# Altium schematic sheet JacdacNRF52833HighPower 32.SchDoc: complete design
size A3; DocumentNumber: 1; SheetNumber: 1; SheetTotal: 1; VersionControl_RevNumber: 1
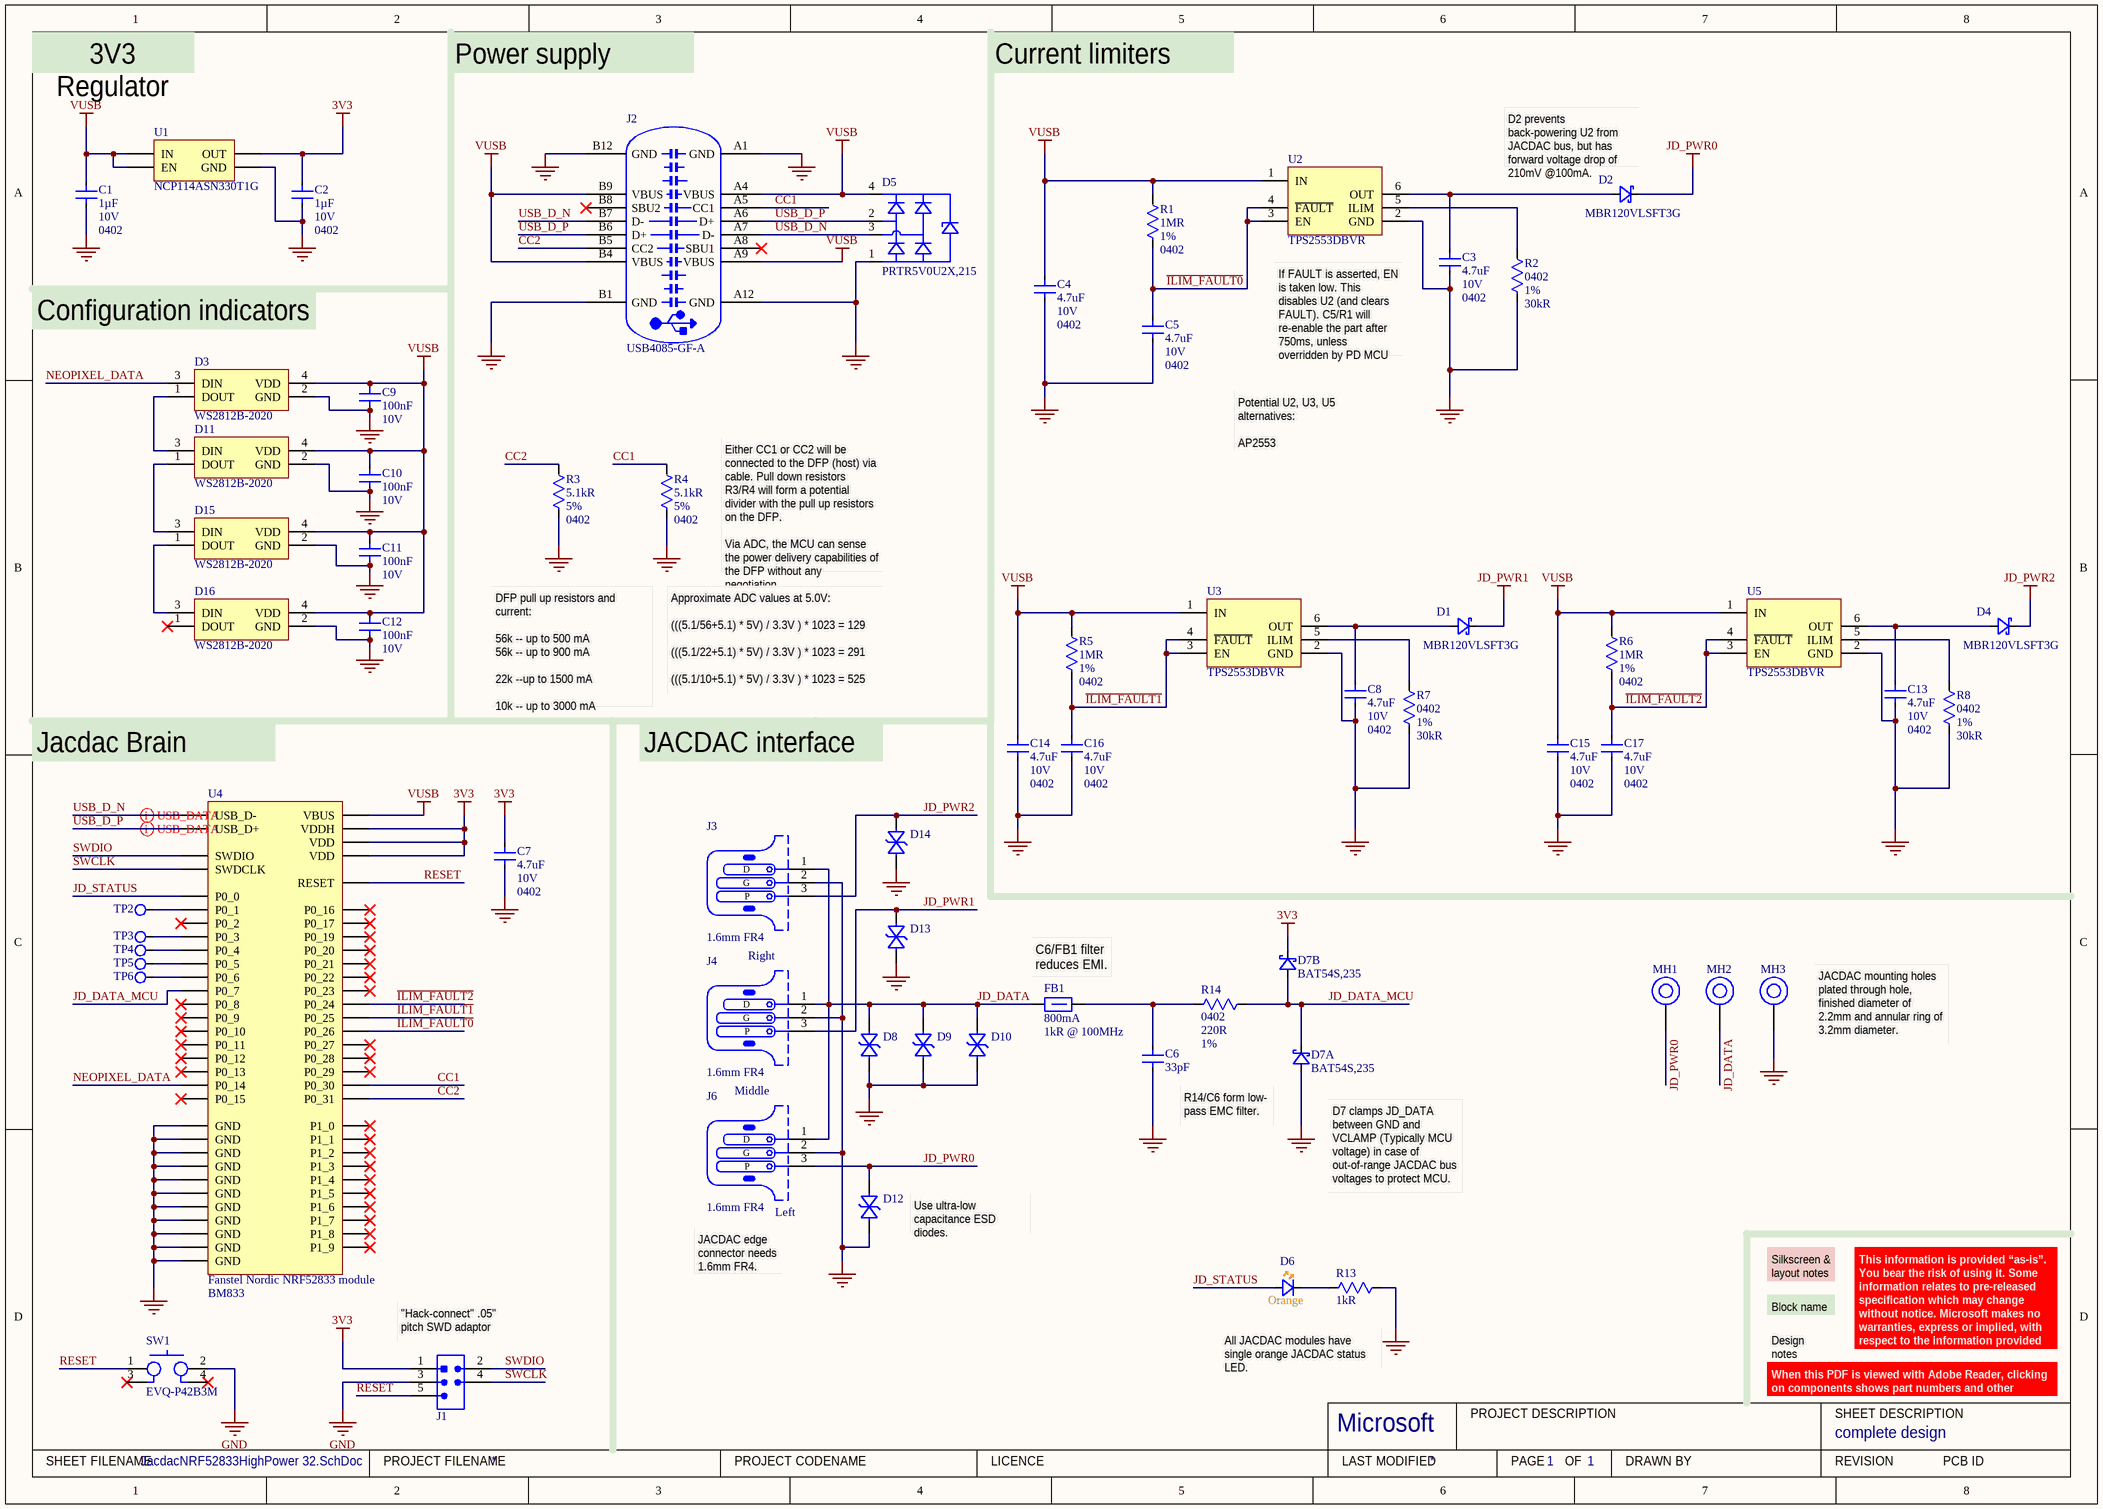
[diagram p0: JacdacNRF52833HighPower 32.SchDoc]

## Parts
C1  Capacitance: 1µF  Voltage Rating: 10V  Case Code (Imperial): 0402  [C0402_0.55MM - without outline]  (hidden comment: CL05A105KP5NNNC)
C2  Capacitance: 1µF  Voltage Rating: 10V  Case Code (Imperial): 0402  [C0402_0.55MM - without outline]  (hidden comment: CL05A105KP5NNNC)
C3  Capacitance: 4.7uF  Voltage Rating: 10V  Case Code (Imperial): 0402  [R0402 - Without outline]  (hidden comment: CL05A475MP5NRNC)
C4  Capacitance: 4.7uF  Voltage Rating: 10V  Case Code (Imperial): 0402  [R0402 - Without outline]  (hidden comment: CL05A475MP5NRNC)
C5  Capacitance: 4.7uF  Voltage Rating: 10V  Case Code (Imperial): 0402  [R0402 - Without outline]  (hidden comment: CL05A475MP5NRNC)
C6  Capacitance: 33pF  [C0402_0.55MM - without outline]  (hidden comment: CL05C330JB51PNC)
C7  Capacitance: 4.7uF  Voltage Rating: 10V  Case Code (Imperial): 0402  [R0402 - Without outline]  (hidden comment: CL05A475MP5NRNC)
C8  Capacitance: 4.7uF  Voltage Rating: 10V  Case Code (Imperial): 0402  [R0402 - Without outline]  (hidden comment: CL05A475MP5NRNC)
C9  Capacitance: 100nF  Voltage Rating: 10V  [C0402_0.55MM - without outline]  (hidden comment: CL05B104KP5NNNC)
C10  Capacitance: 100nF  Voltage Rating: 10V  [C0402_0.55MM - without outline]  (hidden comment: CL05B104KP5NNNC)
C11  Capacitance: 100nF  Voltage Rating: 10V  [C0402_0.55MM - without outline]  (hidden comment: CL05B104KP5NNNC)
C12  Capacitance: 100nF  Voltage Rating: 10V  [C0402_0.55MM - without outline]  (hidden comment: CL05B104KP5NNNC)
C13  Capacitance: 4.7uF  Voltage Rating: 10V  Case Code (Imperial): 0402  [R0402 - Without outline]  (hidden comment: CL05A475MP5NRNC)
C14  Capacitance: 4.7uF  Voltage Rating: 10V  Case Code (Imperial): 0402  [R0402 - Without outline]  (hidden comment: CL05A475MP5NRNC)
C15  Capacitance: 4.7uF  Voltage Rating: 10V  Case Code (Imperial): 0402  [R0402 - Without outline]  (hidden comment: CL05A475MP5NRNC)
C16  Capacitance: 4.7uF  Voltage Rating: 10V  Case Code (Imperial): 0402  [R0402 - Without outline]  (hidden comment: CL05A475MP5NRNC)
C17  Capacitance: 4.7uF  Voltage Rating: 10V  Case Code (Imperial): 0402  [R0402 - Without outline]  (hidden comment: CL05A475MP5NRNC)
D1  MBR120VLSFT3G  [MBR120VLSFT3G]
D2  MBR120VLSFT3G  [MBR120VLSFT3G]
D3  WS2812B-2020  [WS2812B-2020]
D4  MBR120VLSFT3G  [MBR120VLSFT3G]
D5  Manufacturer Part Number: PRTR5V0U2X,215  [NXP-SOT143B-4_V]  (hidden comment: NXP-PRTR5V0U2X,215-4-whitesch)
D6  Right angle mount LED (orange)  [LTST-S220KFKT]  (value not drawn)
D7  Manufacturer Part Number: BAT54S,235  [NXP-BAT54S-TO-236AB]  (hidden comment: BAT54S)  (parts A,B of 2)
D8  VBUS05B1-SD0-G4-08  [0201-VBUS05B1-SD0-G4-08 - Without outline]  (value not drawn)
D9  VBUS05B1-SD0-G4-08  [0201-VBUS05B1-SD0-G4-08 - Without outline]  (value not drawn)
D10  VBUS05B1-SD0-G4-08  [0201-VBUS05B1-SD0-G4-08 - Without outline]  (value not drawn)
D11  WS2812B-2020  [WS2812B-2020]
D12  VBUS05B1-SD0-G4-08  [0201-VBUS05B1-SD0-G4-08 - Without outline]  (value not drawn)
D13  VBUS05B1-SD0-G4-08  [0201-VBUS05B1-SD0-G4-08 - Without outline]  (value not drawn)
D14  VBUS05B1-SD0-G4-08  [0201-VBUS05B1-SD0-G4-08 - Without outline]  (value not drawn)
D15  WS2812B-2020  [WS2812B-2020]
D16  WS2812B-2020  [WS2812B-2020]
FB1  Current Rating: 800mA  Impedance: 1kR @ 100MHz  [TDK MPZ1608 0.8mm - without outline]  (hidden comment: TDK MPZ1608S102ATA00)
J1  Hack Connect Mini 1.27 mm pitch 2-row  [HACK_CONNECT_MINI_5_X_1_27]  (value not drawn)  (no BOM)
J2  USB4085-GF-A  [USB4085-GF-A]
J3  PCB Type: 1.6mm FR4  [JACDAC_EDGE_CONNECTOR_0.2mm_T&G]  (hidden comment: JACDAC edge connector)  (no BOM)
J4  PCB Type: 1.6mm FR4  [JACDAC_EDGE_CONNECTOR_0.2mm_T&G]  (hidden comment: JACDAC edge connector)  (no BOM)
J6  PCB Type: 1.6mm FR4  [JACDAC_EDGE_CONNECTOR_0.2mm_T&G]  (hidden comment: JACDAC edge connector)  (no BOM)
MH1  MH_5.0MMK_3.0MMC_2.1MMD_PTH  [MH_5.0MMK_3.0MMC_2.1MMD_PTH]  (value not drawn)  (no BOM)
MH2  MH_5.0MMK_3.0MMC_2.1MMD_PTH  [MH_5.0MMK_3.0MMC_2.1MMD_PTH]  (value not drawn)  (no BOM)
MH3  MH_5.0MMK_3.0MMC_2.1MMD_PTH  [MH_5.0MMK_3.0MMC_2.1MMD_PTH]  (value not drawn)  (no BOM)
R1  Resistance: 1MR  Tolerance: 1%  Case Code (Imperial): 0402  [R0402 - Without outline]
R2  Case/Package: 0402  Tolerance: 1%  Resistance: 30kR  [R0402]  (hidden comment: 0402 RES SMD 30k 1%)
R3  Resistance: 5.1kR  Tolerance: 5%  Case Code (Imperial): 0402  [R0402 - Without outline]  (hidden comment: RC0402JR-075K1L)
R4  Resistance: 5.1kR  Tolerance: 5%  Case Code (Imperial): 0402  [R0402 - Without outline]  (hidden comment: RC0402JR-075K1L)
R5  Resistance: 1MR  Tolerance: 1%  Case Code (Imperial): 0402  [R0402 - Without outline]
R6  Resistance: 1MR  Tolerance: 1%  Case Code (Imperial): 0402  [R0402 - Without outline]
R7  Case/Package: 0402  Tolerance: 1%  Resistance: 30kR  [R0402]  (hidden comment: 0402 RES SMD 30k 1%)
R8  Case/Package: 0402  Tolerance: 1%  Resistance: 30kR  [R0402]  (hidden comment: 0402 RES SMD 30k 1%)
R13  Resistance: 1kR  [R0402 - Without outline]  (hidden comment: RC0402FR-071KL)
R14  Case Code (Imperial): 0402  Resistance: 220R  Tolerance: 1%  [R0402 - Without outline]  (hidden comment: RC0402FR-07220RL)
SW1  Side mount digital switch.  [EVQ-P42B3M]  (value not drawn)
TP2  TestPoint  [Pad1.27mm]  (value not drawn)  (no BOM)
TP3  TestPoint  [Pad1.27mm]  (value not drawn)  (no BOM)
TP4  TestPoint  [Pad1.27mm]  (value not drawn)  (no BOM)
TP5  TestPoint  [Pad1.27mm]  (value not drawn)  (no BOM)
TP6  TestPoint  [Pad1.27mm]  (value not drawn)  (no BOM)
U1  LDO 3.3V/300 mA  [ON_SEMI-SOT23-5]  (value not drawn)
U2  Manufacturer Part Number 1: TPS2553DBVR  [TI-TPS2553]  (hidden comment: TPS2553DBVR_ALT)
U3  Manufacturer Part Number 1: TPS2553DBVR  [TI-TPS2553]  (hidden comment: TPS2553DBVR_ALT)
U4  Fanstel Nordic NRF52833 module  [BM833]
U5  Manufacturer Part Number 1: TPS2553DBVR  [TI-TPS2553]  (hidden comment: TPS2553DBVR_ALT)

## Nets
3V3: C2.2 C7.2 D7.2(K) J1.1(VCC) U1.5(OUT) U4.14(VDD) U4.28(VDD) U4.56(VDDH)
GND: C1.1 C2.1 C3.1 C4.1 C5.1 C6.1 C7.1 C8.1 C9.1 C10.1 C11.1 C12.1 C13.1 C14.1 C15.1 C16.1 C17.1 D3.2(GND) D5.1(GND) D7.1(A) D8.2(A) D9.2(A) D10.2(A) D11.2(GND) D12.2(A) D13.2(A) D14.2(A) D15.2(GND) D16.2(GND) J1.3(GND) J2.A1(GND) J2.A12(GND) J2.B1(GND) J2.B12(GND) J3.2(G) J4.2(G) J6.2(G) MH3.1 R2.1 R3.2 R4.2 R7.1 R8.1 R13.1 SW1.2(B) U1.2(GND) U2.2(GND) U3.2(GND) U4.1(GND) U4.2(GND) U4.3(GND) U4.4(GND) U4.5(GND) U4.13(GND) U4.15(GND) U4.18(GND) U4.19(GND) U4.30(GND) U4.45(GND) U5.2(GND)
JD_PWR0: D2.1(K) D12.1(K) J6.3(P) MH1.1
JD_PWR1: D1.1(K) D13.1(K) J4.3(P)
JD_PWR2: D4.1(K) D14.1(K) J3.3(P)
VUSB: C1.2 C4.2 C9.2 C10.2 C11.2 C12.2 C14.2 C15.2 D3.4(VDD) D5.4(VCC) D11.4(VDD) D15.4(VDD) D16.4(VDD) J2.A4(VBUS) J2.A9(VBUS) J2.B4(VBUS) J2.B9(VBUS) R1.1 R5.1 R6.1 U1.1(IN) U1.3(EN) U2.1(IN) U3.1(IN) U4.58(VBUS) U5.1(IN)
~{ILIM_FAULT0}: C5.2 R1.2 U2.3(EN) U2.4(~{FAULT}) U4.7(P0_26)
~{ILIM_FAULT1}: C16.2 R5.2 U3.3(EN) U3.4(~{FAULT}) U4.55(P0_25)
~{ILIM_FAULT2}: C17.2 R6.2 U4.47(P0_24) U5.3(EN) U5.4(~{FAULT})
CC1: J2.A5(CC1) R4.1 U4.11(P0_30)
CC2: J2.B5(CC2) R3.1 U4.12(P0_31)
JD_DATA: D8.1(K) D9.1(K) D10.1(K) FB1.1 J3.1(D) J4.1(D) J6.1(D) MH2.1
JD_DATA_MCU: D7.3(K) R14.1 U4.24(P0_7)
JD_STATUS: D6.2(A) U4.16(P0_0)
NEOPIXEL_DATA: D3.3(DIN) U4.33(P0_14)
RESET: J1.5(RESET) SW1.1(A) U4.40(RESET)
SWCLK: J1.4(SWCLK) U4.42(SWDCLK)
SWDIO: J1.2(SWDIO) U4.43(SWDIO)
USB_D_N: D5.3(I/O2) J2.A7(D-) J2.B7(D-) U4.68(USB_D-)
USB_D_P: D5.2(I/O1) J2.A6(D+) J2.B6(D+) U4.67(USB_D+)
NetC3_2: C3.2 D2.2(A) U2.6(OUT)
NetC6_2: C6.2 FB1.2 R14.2
NetC8_2: C8.2 D1.2(A) U3.6(OUT)
NetC13_2: C13.2 D4.2(A) U5.6(OUT)
NetD3_1: D3.1(DOUT) D11.3(DIN)
NetD6_1: D6.1(K) R13.2
NetD11_1: D11.1(DOUT) D15.3(DIN)
NetD15_1: D15.1(DOUT) D16.3(DIN)
NetR2_2: R2.2 U2.5(ILIM)
NetR7_2: R7.2 U3.5(ILIM)
NetR8_2: R8.2 U5.5(ILIM)
NetTP2_1: TP2.1 U4.17(P0_1)
NetTP3_1: TP3.1 U4.20(P0_3)
NetTP4_1: TP4.1 U4.21(P0_4)
NetTP5_1: TP5.1 U4.23(P0_5)
NetTP6_1: TP6.1 U4.25(P0_6)

Not connected (* = marked no-connect by the designer): D16 1(DOUT)*; J2 A8(SBU1)* B8(SBU2)*; SW1 3(A)* 4(B)*; U4 8(P0_27)* 9(P0_28)* 10(P0_29)* 22(P0_2)* 26(P0_9)* 27(P0_8)* 29(P0_10)* 31(P1_1)* 32(P1_2)* 34(P0_11)* 35(P0_15)* 36(P0_16)* 37(P0_17)* 38(P1_0)* 41(P0_13)* 44(P0_22)* 48(P0_19)* 49(P1_3)* 51(P1_5)* 52(P1_9)* 53(P0_23)* 54(P1_8)* 60(P0_21)* 61(P1_4)* 62(P0_20)* 64(P0_12)* 65(P1_6)* 66(P1_7)*

## Layout directives
differential pair; rule Signal Stimulus [Kind - Single Pulse    Level - High    Start Time = 0.000    Stop Time = 41.67n    Period Time = 83.33n]: USB_D_N
differential pair; rule Signal Stimulus [Kind - Single Pulse    Level - High    Start Time = 0.000    Stop Time = 500.0m    Period Time = 1.000]: USB_D_P

## Notes on the sheet
- 3V3 Regulator
- Power supply
- Current limiters
- (near D2) D2 prevents back-powering U2 from JACDAC bus, but has forward voltage drop of 210mV @100mA.
- Configuration indicators
- If FAULT is asserted, EN is taken low. This disables U2 (and clears FAULT). C5/R1 will re-enable the part after 750ms, unless overridden by PD MCU
- Potential U2, U3, U5 alternatives:
  AP2553
- Either CC1 or CC2 will be connected to the DFP (host) via cable. Pull down resistors R3/R4 will form a potential divider with the pull up resistors on the DFP.
  Via ADC, the MCU can sense the power delivery capabilities of the DFP without any negotiation.
- DFP pull up resistors and current:
  56k -- up to 500 mA
  56k -- up to 900 mA
  22k --up to 1500 mA
  10k -- up to 3000 mA
- Approximate ADC values at 5.0V:
  (((5.1/56+5.1) * 5V) / 3.3V ) * 1023 = 129
  (((5.1/22+5.1) * 5V) / 3.3V ) * 1023 = 291
  (((5.1/10+5.1) * 5V) / 3.3V ) * 1023 = 525
- Jacdac Brain
- JACDAC interface
- Right
- (near FB1) C6/FB1 filter reduces EMI.
- (near MH3) JACDAC mounting holes  plated through hole, finished diameter of 2.2mm and annular ring of 3.2mm diameter.
- Middle
- R14/C6 form low-
  pass EMC filter.
- (near D7) D7 clamps JD_DATA between GND and VCLAMP (Typically MCU voltage) in case of out-of-range JACDAC bus voltages to protect MCU.
- (near J6) Left
- (near D12) Use ultra-low capacitance ESD diodes.
- JACDAC edge connector needs 1.6mm FR4.
- Block name
- Silkscreen & layout notes
- (near J1) "Hack-connect" .05" pitch SWD adaptor
- All JACDAC modules have single orange JACDAC status LED.
- Design notes
- When this PDF is viewed with Adobe Reader, clicking on components shows part numbers and other details.
- This information is provided “as-is”. You bear the risk of using it. Some information relates to pre-released specification which may change without notice. Microsoft makes no warranties, express or implied, with respect to the information provided here.
- Microsoft
- PROJECT DESCRIPTION
- SHEET DESCRIPTION
- SHEET FILENAME
- PROJECT FILENAME
- PROJECT CODENAME
- LICENCE
- LAST MODIFIED
- PAGE
- OF
- DRAWN BY
- REVISION
- PCB ID

## Library data of the parts
C1 C2 = CL05A105KP5NNNC: CAP CER 1UF 10V X5R 0402; Manufacturer: Samsung; Material: Ceramic; Tolerance: 10%; Supplier 1: Digi-Key; Manufacturer Part Number: CL05A105KP5NNNC; RoHS: Yes; Category: Capacitors; Stock 1: 5705569; Pricing 1: 1=0.10000, 10=0.03900, 50=0.02100, 100=0.01720, 500=0.01228, 1000=0.00965, 2500=0.00877, 5000=0.00807 (USD); Mount: Surface Mount; Case/Package: 0402; Case Code (Metric): 1005; Contact Plating: Tin; Min Operating Temperature: -55°C; Max Operating Temperature: 85°C; Dielectric: X5R; Package Quantity: 1; Packaging: Tape and Reel; Length: 1mm; Height: 0.5mm; Width: 0.02inch; Thickness: 0.022inch; Depth: 0.5mm; Radiation Hardening: No; ComponentLink1URL: https://datasheet.ciiva.com/15195/getdatasheetpartid-358390-15195630.pdf; ComponentLink1Description: Online datasheet; Supplier 2: Mouser; Stock 2: 928941; Pricing 2: 1=0.10000, 10=0.04200, 100=0.01800, 500=0.01300, 1000=0.01000, 2500=0.00900 (USD); Supplier 3: Farnell; Stock 3: 53670; Pricing 3: 10=0.02450, 100=0.02000, 500=0.01310, 2500=0.00920, 5000=0.00810, 10000=0.00640, 50000=0.00490 (GBP); Supplier Part Number 3: 3013329; Supplier Part Number 2: 187-CL05A105KP5NNNC; Supplier Part Number 1: 1276-1076-1-ND; Created: DG; Checked: ?
C3-C5 C7 C8 C13-C17 = CL05A475MP5NRNC: CAP CER 4.7UF 10V X5R 0402; Manufacturer: Samsung; Tolerance: 20%; Supplier 1: Digi-Key; Manufacturer Part Number: CL05A475MP5NRNC; RoHS: Yes; Category: Ceramic Capacitors; Stock 1: 840000; Pricing 1: 10000=0.01405, 20000=0.01338 (USD); Mount: Surface Mount; Case/Package: 0402; Case Code (Metric): 1005; Min Operating Temperature: -55°C; Max Operating Temperature: 85°C; Package Quantity: 10000; Packaging: Tape and Reel; Dielectric: X5R; Series: CL; Length: 0.039inch; Width: 0.02inch; Thickness: 0.022inch; Lead Free: Lead Free; RoHS Compliant: Yes; ComponentLink1URL: https://datasheet.ciiva.com/25786/cl05a475mp5nrnc-25786963.pdf; ComponentLink1Description: Online datasheet; Supplier 2: Future Electronics; Stock 2: 2004; Pricing 2: 1=0.23500, 500=0.03970, 1500=0.02900, 2500=0.02500, 5000=0.02050 (USD); Created By: D. Gakure; Checked By: ?; Supplier Part Number 2: 2103694; Supplier Part Number 1: 1276-1482-2-ND
C6 = CL05C330JB51PNC: CAP CER 33PF 50V NP0 0402; Manufacturer: Samsung; Tolerance: 5%; Supplier 1: Digi-Key; Manufacturer Part Number: CL05C330JB51PNC; RoHS: Yes; Category: Capacitors; Stock 1: 250654; Pricing 1: 1=0.10000, 10=0.07500, 50=0.04060, 100=0.03320, 500=0.02374, 1000=0.01865, 2500=0.01696, 5000=0.01560 (USD); Mount: Surface Mount; Case/Package: 0402; Case Code (Metric): 1005; Min Operating Temperature: -55°C; Max Operating Temperature: 125°C; Packaging: Tape and Reel; Length: 0.039inch; Width: 0.02inch; Thickness: 0.022inch; Ratings: AEC-Q200; Lead Free: Lead Free; ComponentLink1URL: http://www.samsungsem.com/kr/support/library/product-catalog/mlcc.jsp; ComponentLink1Description: Samsung datasheet online; Supplier 2: Mouser; Stock 2: 97900; Pricing 2: 1=0.11000, 10=0.08200, 100=0.03600, 500=0.02600, 1000=0.02000, 2500=0.01800 (USD); Supplier 3: Future Electronics; Stock 3: 100000; Pricing 3: 10000=0.00780 (USD); Supplier Part Number 3: 6022520; Supplier Part Number 2: 187-CL05C330JB51PNC; Checked: ?; Created: DG; Supplier Part Number 1: 1276-6515-1-ND; Voltage Rating: 50V; Case Code (Imperial): 0402
C9-C12 = CL05B104KP5NNNC: CAP CER 0.1UF 10V X7R 0402; Manufacturer: Samsung; Tolerance: 10%; Supplier 1: Digi-Key; Manufacturer Part Number: CL05B104KP5NNNC; RoHS: Yes; Category: Ceramic Capacitors; Stock 1: 17321183; Pricing 1: 1=0.10000, 10=0.02500, 50=0.01380, 100=0.01130, 500=0.00804, 1000=0.00632, 2500=0.00575, 5000=0.00529 (USD); Mount: Surface Mount; Case/Package: 0402; Case Code (Imperial): 0402; Case Code (Metric): 1005; Contact Plating: Tin; Min Operating Temperature: -55°C; Max Operating Temperature: 125°C; Package Quantity: 1; Packaging: Tape and Reel; Dielectric: X7R; Length: 1mm; Width: 0.02inch; Height: 0.5mm; Thickness: 0.022inch; Depth: 0.5mm; Radiation Hardening: No; ComponentLink1URL: https://datasheet.ciiva.com/15165/getdatasheetpartid-37100-15165107.pdf; ComponentLink1Description: Samsung datasheet online; Supplier 2: Mouser; Stock 2: 984124; Pricing 2: 10000=0.00400, 20000=0.00400, 50000=0.00400 (USD); Supplier 3: Farnell; Stock 3: 39022; Pricing 3: 10=0.01620, 100=0.01310, 500=0.00740, 2500=0.00600, 5000=0.00470, 10000=0.00400, 50000=0.00320 (GBP); Supplier 4: Newark; Stock 4: 56730; Pricing 4: 1=0.09000, 25=0.02300, 100=0.01000, 250=0.00900, 500=0.00700, 1000=0.00500, 2500=0.00500 (USD); Supplier 5: Future Electronics; Stock 5: 20877033; Pricing 5: 1=0.00460, 500=0.00340, 1500=0.00320, 2500=0.00310, 5000=0.00300 (USD); Supplier Part Number 5: 9032525; Supplier Part Number 4: 82AC9219; Supplier Part Number 2: 187-CL05B104KP5NNNC; Supplier Part Number 1: 1276-1002-1-ND; Created: DG; Checked: ?; Supplier Part Number 3: 3013351
D1 D2 D4 = MBR120VLSFT3G: DIODE SCHOTTKY 20V 1A SOD123FL; Manufacturer: ON Semiconductor; Max Surge Current: 45A; Forward Voltage: 340mV; Peak Reverse Current: 600uA; Element Configuration: Single; Polarity: Standard; Supplier 1: Digi-Key; RoHS: Yes; Category: Schottky Diodes; Stock 1: 32481; Pricing 1: 1=0.39000, 10=0.28600, 100=0.19920, 500=0.12616, 1000=0.10292, 2000=0.09960, 5000=0.09628 (USD); Number of Pins: 2; Min Operating Temperature: -65°C; Max Operating Temperature: 125°C; Package Quantity: 10000; Forward Current: 1A; Packaging: Tape and Reel; Max Reverse Leakage Current: 600uA; Average Rectified Current: 1A; Peak Non-Repetitive Surge Current: 45A; Max Repetitive Reverse Voltage (Vrrm): 20V; Max Forward Surge Current (Ifsm): 45A; Voltage Rating (DC): 20V; Current Rating: 1A; Output Current: 1A; Max Reverse Voltage (DC): 20V; Radiation Hardening: No; REACH SVHC: No SVHC; Lead Free: Lead Free; Halogen Free: Halogen Free; ComponentLink4URL: https://datasheet.ciiva.com/6380/mbr120vlsft1-d-6380910.pdf; ComponentLink4Description: On Semi datasheet online; Supplier 2: Mouser; Supplier 3: RSComponents; Supplier Part Number 3: 1867479; Supplier Part Number 2: 863-MBR120VLSFT3G; Supplier Part Number 1: MBR120VLSFT3GOSCT-ND; Manufacturer Part Number: MBR120VLSFT3G
D3 D11 D15 D16 = WS2812B-2020: WS2812B RGB LED (Neopixel) 2.0mm x 2.0mm; Vih: 2.7; Vil: -0.3; VDD: 3.7-5.3; ComponentLink1Description: datasheet (offline); ComponentLink1URL: Y:\System\Altium\Libraries 2014\WorldSemi\Datasheets\Worldsemi_WS2812B-2020.pdf; ComponentLink2Description: datasheet (online); ComponentLink2URL: https://datasheet.lcsc.com/lcsc/2012110135_Worldsemi-WS2812B-2020_C965555.pdf; Manufacturer Part Number: WS2812B-2020
D5 = NXP-PRTR5V0U2X,215-4-whitesch: USB TVS and ESD protection diodes; Manufacturer: NXP Semiconductors; Capacitance: 16pF; Breakdown Voltage: 6V; Direction: Unidirectional; Number of Channels: 2; Number of Elements: 1; Polarity: Bidirectional,Unidirectional; Working Voltage: 5.5V; Power Line Protection: Yes; Leakage Current: 100nA; Max Breakdown Voltage: 9V; Max Reverse Leakage Current: 100uA; Supplier 1: Digi-Key; Stock 1: 109808; Pricing 1: 1=0.55, 10=0.47, 100=0.3507, 500=0.27552, 1000=0.2129 (USD); Mount: Surface Mount; Case/Package: SOT; Number of Pins: 4; Weight: 0.001lb; Contact Plating: Tin; Min Operating Temperature: -40°C; Max Operating Temperature: 85°C; Packaging: Tape and Reel; Termination: SMD/SMT; Reverse Breakdown Voltage: 6V; Package Quantity: 1; Number of Bidirectional Channels: 2; Reverse Standoff Voltage: 5.5V; Min Breakdown Voltage: 6V; ESD Protection: Yes; Length: 3mm; Height: 1.1mm; Width: 1.4mm; Depth: 1.4mm; Radiation Hardening: No; REACH SVHC: No SVHC; Lead Free: Lead Free; ComponentLink8URL: http://www.farnell.com/datasheets/109718.pdf?src-supplier=Farnell; ComponentLink8Description: NXP datasheet; Supplier 2: Farnell; Supplier 3: RSComponents; Supplier 4: Mouser; Supplier Part Number 4: 771-PRTR5V0U2X-T/R; Supplier Part Number 3: 725-8720; Supplier Part Number 2: 2371119; Supplier Part Number 1: 1727-3884-1-ND
D6 = LTST-S220KFKT: LED ORANGE CLEAR SMD R/A; Manufacturer 1: Vishay Lite-On; Color: Orange,Yellow; Lens Color: Colorless; Viewing Angle: 130°; Lens Style: Clear,Diffused,Colorless,Rectangular; Luminous Intensity: 90mcd; Forward Current: 20mA; Forward Voltage: 2V; Dominant Wavelength: 605nm; Number of Elements: 1; Power Dissipation: 75mW; Reverse Voltage: 5V; Wavelength: 611nm; Supplier 1: Digi-Key; RoHS: Yes; Category: LEDs; Stock 1: 4947; Pricing 1: 1=0.23000, 10=0.12400, 100=0.05750, 500=0.05310, 1000=0.04160, 2000=0.04071 (USD); Mount: Surface Mount; Case/Package: SMD/SMT; Number of Pins: 2; Min Operating Temperature: -55°C; Max Operating Temperature: 85°C; Packaging: Tape and Reel; Package Quantity: 4000; Illumination Color: Orange; Lens Transparency: Clear; Test Current: 20mA; Number of LEDs: 1; Series: -; Power Rating: 75mW; Length: 2.1mm; Width: 1mm; Height: 0.6mm; Depth: 0.6mm; Radiation Hardening: No; RoHS Compliant: Yes; Supplier 2: RSComponents; Supplier 3: Mouser; ComponentLink1Description: datasheet (online); ComponentLink1URL: https://optoelectronics.liteon.com/upload/download/DS22-2000-136/LTST-S220KFKT.pdf; ComponentLink2Description: datasheet (offline); ComponentLink2URL: Y:\System\Altium\Libraries 2014\Lite-On\datasheets\LTST-S220KFKT.pdf; Supplier Part Number 1: 160-2031-1-ND; Supplier Part Number 2: 6921186P; Supplier Part Number 3: 859-LTST-S220KFKT; Manufacturer Part Number 1: LTST-S220KFKT
D7 = BAT54S: DIODE ARRAY SCHOTTKY 30V SOT23; Manufacturer: Nexperia; Supplier 1: Digi-Key; RoHS: No; Category: Rectifier Diodes; Stock 1: 14011; Pricing 1: 1=0.13000, 10=0.11900, 100=0.05610, 500=0.03326, 1000=0.02185, 5000=0.02138 (USD); ComponentLink1URL: https://assets.nexperia.com/documents/data-sheet/BAT54_SER.pdf; ComponentLink1Description: NXP datasheet online; Supplier 2: Mouser; Supplier 3: RSComponents; Supplier Part Number 2: 771-BAT54S235; Supplier Part Number 3: 1707990; Supplier Part Number 1: 1727-1868-1-ND
D8-D10 D12-D14 = VBUS05B1-SD0-G4-08: TVS DIODE 5.5V 18V CLP0603; Manufacturer: Vishay Semiconductors; Peak Pulse Current: 2.5A; Number of Bidirectional Channels: 1; Min Breakdown Voltage: 6V; Peak Pulse Power: 45W; Power Line Protection: No; Direction: Bidirectional; Capacitance: 0.4pF; Element Configuration: Single; Supplier 1: Digi-Key; RoHS: Yes; Category: TVS Diodes; Stock 1: 22028; Pricing 1: 1=0.27000, 10=0.18500, 100=0.09020, 500=0.07524, 1000=0.05228, 2000=0.04531, 5000=0.04203 (USD); Mount: Surface Mount; Case/Package: 0201; Number of Pins: 2; Case Code (Metric): 0603; Case Code (Imperial): 0201; Min Operating Temperature: -55°C; Max Operating Temperature: 150°C; Packaging: Tape and Reel; Reverse Standoff Voltage: 5.5V; Clamping Voltage: 18V; Working Voltage: 5.5V; Resistor Type: Zener; ComponentLink2URL: http://www.vishay.com/docs/85899/vbus05b1-sd0.pdf; ComponentLink2Description: Online datasheet; Supplier 2: Farnell; Stock 2: 13100; Pricing 2: 5=0.20800, 10=0.14000, 100=0.06340, 500=0.05020, 1000=0.04160, 5000=0.03300 (GBP); Supplier 3: Mouser; Stock 3: 1209; Pricing 3: 1=0.27000, 10=0.18500, 50=0.18500, 100=0.09300, 1000=0.03900, 10000=0.03400 (USD); Supplier 4: Arrow Electronics; Stock 4: 719; Pricing 4: 1=0.17630, 10=0.14370, 25=0.14230, 100=0.07810, 250=0.07660, 500=0.06310, 15000=0.02980, 150000=0.02970, 1500000=0.02870, 7500000=0.02800 (USD); Supplier Part Number 4: VBUS05B1-SD0-G4-08; Supplier Part Number 3: 78-VBUS05B1SD0-G4-08; Supplier Part Number 1: VBUS05B1-SD0-G4-08GICT-ND; Supplier Part Number 2: 2932858; Created By: D. Gakure; Checked By: ?; Manufacturer Part Number: VBUS05B1-SD0-G4-08
FB1 = TDK MPZ1608S102ATA00: 0603 1k@100MHz 0.8A chip; Core Material: Ferrite; Tolerance: 25%; DC Resistance (DCR): 300mR; Supplier 1: Digi-Key; Stock 1: 113542; Pricing 1: 1=0.1, 10=0.079, 25=0.0716, 50=0.0644, 100=0.0472, 250=0.03432, 500=0.03146, 1000=0.02717 (USD); Mount: Surface Mount; Case/Package: 0603; Case Code (Metric): 1608; Case Code (Imperial): 0603; Package Quantity: 4000; Packaging: Tape and Reel; Max DC Current: 800mA; Length: 0.063inch; Height: 0.037inch; Width: 0.031inch; ComponentLink2URL: https://www.mouser.co.uk/datasheet/2/400/eads_commercial_power_mpz1608_en-923650.pdf; ComponentLink2Description: datasheet online; Supplier 2: Mouser; ComponentLink3Description: datasheet; ComponentLink3URL: Y:\System\Altium\Libraries 2014\TDK\Datasheets\eads_commercial_power_mpz1608_en-923650.pdf; Supplier Part Number 1: 445-8694-1-ND; Supplier Part Number 2: 810-MPZ1608S102ATA00; Manufacturer: TDK; Manufacturer Part Number: MPZ1608S102ATA00
J1 = HACK_CONNECT_MINI
J2 = USB4085-GF-A: USB4085 Series 20 V PCB Top Mount USB 2.0 Type C Receptacle; Manufacturer 1: Global Connector Technology; USB Standard: USB 2.0; Number of Positions: 16; Supplier 1: Digi-Key; RoHS: Yes; Category: USB Connectors; Stock 1: 17632; Pricing 1: 1=1.340000, 10=1.178000, 25=1.108800, 50=1.062600, 100=1.016400, 250=0.924000 (USD); Contact Material: Copper Alloy; Contact Plating: Gold; Gender: Receptacle; Orientation: Right Angle; ComponentLink2URL: https://datasheet.ciiva.com/71788/usb4085-71788147.pdf?src-supplier=Digi-Key; ComponentLink2Description: Datasheet (online); Supplier 2: Farnell; Supplier Part Number 1: 2073-USB4085-GF-ACT-ND; Supplier Part Number 2: 2924867; Manufacturer Part Number 1: USB4085-GF-A
J3 J4 J6 = JACDAC edge connector: 3 pin jacdac edge connector 1.27mm pitch; Manufacturer Part Number: JACDAC_EDGE_CONNECTOR; Checked By: ?; Created By: D. Gakure; ComponentLink1Description: Yuliang JACDAC cable connector drawing online; ComponentLink1URL: https://github.com/microsoft/jacdac-mdk/blob/main/connector/JACDAC-Connector-by-Yuliang-2020-11-28.pdf; ComponentLink2Description: JACDAC PCB edge connector spec onlin; ComponentLink2URL: https://github.com/microsoft/jacdac-mdk/blob/main/connector/JACDAC_PCB_Edge_Connector_Drawing_JD-PEC-01_rev_01.pdf
MH1-MH3 = MH_5.0MMK_3.0MMC_2.1MMD_PTH: Mounting Hole 5.0mm keepout, 3.0mm annualar ring and 2.1mm Drill PTH
R1 R5 R6 = RC0402FR-071ML: RES SMD 1M OHM 1% 1/16W 0402; Manufacturer: Yageo; Power Rating: 63mW; Voltage Rating: 50V; Temperature Coefficient: 100ppm/°C; Supplier 1: Digi-Key; Manufacturer Part Number: RC0402FR-071ML; RoHS: Yes; Category: Chip SMD Resistors; Stock 1: 7856490; Pricing 1: 1=0.10000, 10=0.01600, 100=0.00640, 1000=0.00286, 2500=0.00248, 5000=0.00205 (USD); Case/Package: 0402; Case Code (Metric): 1005; Size Code: 0402; Min Operating Temperature: -55°C; Max Operating Temperature: 155°C; Resistor Type: Thick Film; Packaging: Tape and Reel; Termination: SMD/SMT; Features: Moisture Resistant; Series: RC; Max Power Dissipation: 63mW; Number of Terminations: 2; Resistance Tolerance: 1%; Construction: Rectangular; Technology: THICK FILM; Length: 1mm; Height: 0.32mm; Depth: 0.5mm; RoHS Compliant: Yes; REACH SVHC: Unknown; Military Standard: Not; Lead Free: Lead Free; ComponentLink1URL: https://datasheet.ciiva.com/11808/0900766b80c66297-11808125.pdf; ComponentLink1Description: Online datasheet; Supplier 2: Mouser; Stock 2: 1194490; Pricing 2: 1=0.10000, 10=0.01200, 50=0.01200, 100=0.00400, 1000=0.00400, 10000=0.00300 (USD); Supplier 3: Farnell; Stock 3: 1530000; Pricing 3: 10000=0.00290, 50000=0.00200 (GBP); Created By: D. Gakure; Supplier Part Number 2: 603-RC0402FR-071ML; Supplier Part Number 1: 311-1.00MLRCT-ND; Checked By: ?; Supplier Part Number 3: 2421892
R2 R7 R8 = RC0402FR-0730KL: YAGEO - RC0402FR-0730KL - RES, 30K, 1%, 0.063W, 0402, THICK FILM; Power Rating: 62.5mW; Voltage Rating: 50V; Temperature Coefficient: 100ppm/°C; Max Power Dissipation: 63mW; Supplier 1: Digi-Key; Manufacturer 1: Yageo; Manufacturer Part Number 1: RC0402FR-0730KL; RoHS: Yes; Category: Chip SMD Resistors; Pricing 1: 1=0.10000, 10=0.01600, 100=0.00660, 1000=0.00299, 2500=0.00259, 5000=0.00214 (USD); Case Code (Imperial): 0402; Case Code (Metric): 1005; Size Code: 0402; Weight: 2.3E-05oz; Min Operating Temperature: -55°C; Max Operating Temperature: 155°C; Packaging: Tape and Reel; Termination: SMD/SMT; Resistor Type: Thick Film; Voltage Rating (DC): 50V; Features: Moisture Resistant; Series: RC; Number of Terminations: 2; Resistance Tolerance: 1%; Construction: Rectangular; Length: 1mm; Width: 0.5mm; Height: 0.35mm; Depth: 0.5mm; REACH SVHC: Unknown; Military Standard: Not; Lead Free: Lead Free; RoHS Compliant: Yes; ComponentLink1URL: https://datasheet.ciiva.com/7849/1018594-7849957.pdf?src-supplier=Element14; ComponentLink1Description: https://datasheet.ciiva.com/7849/1018594-7849957.pdf?src-supplier=Element14; ComponentLink2URL: https://datasheet.ciiva.com/46394/1018594-46394938.pdf?src-supplier=Element14; ComponentLink2Description: https://datasheet.ciiva.com/46394/1018594-46394938.pdf?src-supplier=Element14; ComponentLink3URL: https://datasheet.ciiva.com/12577/pyu-rc0402-51-rohs-l-6-r-12577743.pdf?src-supplier=Mouser; ComponentLink3Description: https://datasheet.ciiva.com/12577/pyu-rc0402-51-rohs-l-6-r-12577743.pdf?src-supplier=Mouser; Supplier 2: Farnell; Supplier 3: Mouser; Supplier Part Number 3: 603-RC0402FR-0730KL; Supplier Part Number 1: 311-30.0KLRCT-ND; Supplier Part Number 2: 1458778RL
R3 R4 = RC0402JR-075K1L: RES SMD 5.1K OHM 5% 1/16W 0402; Manufacturer: Yageo; Voltage Rating: 50V; Power Rating: 62.5mW; Temperature Coefficient: 100ppm/°C; Max Power Dissipation: 63mW; Supplier 1: Digi-Key; Manufacturer Part Number: RC0402JR-075K1L; RoHS: Yes; Category: Chip SMD Resistors; Stock 1: 1270619; Pricing 1: 1=0.10000, 10=0.01300, 100=0.00520, 1000=0.00233, 2500=0.00202, 5000=0.00167 (USD); Case/Package: 0402; Case Code (Metric): 1005; Weight: 2.3E-05oz; Size Code: 0402; Min Operating Temperature: -55°C; Max Operating Temperature: 155°C; Packaging: Tape and Reel; Resistor Type: Thick Film; Termination: SMD/SMT; Voltage Rating (DC): 50V; Features: Moisture Resistant; Series: RC; Number of Terminations: 2; Construction: Rectangular; Resistance Tolerance: 5%; Length: 1mm; Width: 0.5mm; Height: 0.35mm; Depth: 0.5mm; REACH SVHC: No SVHC; Military Standard: Not; Lead Free: Lead Free; RoHS Compliant: Yes; ComponentLink2URL: https://datasheet.ciiva.com/16740/pyu-rc0402-51-rohs-l-6-r-16740925.pdf; ComponentLink2Description: Onnline datasheet; Supplier 2: Newark; Stock 2: 1265; Pricing 2: 1=0.10000, 25=0.01000, 100=0.00400, 250=0.00400, 500=0.00300, 1000=0.00300 (USD); Supplier 3: Mouser; Stock 3: 100817; Pricing 3: 1=0.10000, 10=0.01000, 50=0.01000, 100=0.00400, 1000=0.00300, 10000=0.00200 (USD); Supplier 4: Farnell; Stock 4: 68890; Pricing 4: 10=0.00910, 100=0.00390, 500=0.00320, 2500=0.00240, 5000=0.00210, 10000=0.00190, 50000=0.00150 (GBP); Supplier 5: Farnell; Stock 5: 1265; Pricing 5: 10000=0.00270 (GBP); Supplier Part Number 5: 1799293; Supplier Part Number 4: 3495714; Supplier Part Number 3: 603-RC0402JR-075K1L; Supplier Part Number 2: 68R0016; Supplier Part Number 1: 311-5.1KJRCT-ND; Created By: D. Gakure; Checked By: ?
R13 = RC0402FR-071KL: RES SMD 1K OHM 1% 1/16W 0402; Manufacturer: Yageo; Temperature Coefficient: 100ppm/°C; Voltage Rating (DC): 50V; Power Rating: 62.5mW; Supplier 1: Digi-Key; Manufacturer Part Number: RC0402FR-071KL; RoHS: Yes; Category: Resistors; Stock 1: 37591306; Pricing 1: 1=0.10000, 10=0.01400, 100=0.00580, 1000=0.00262, 2500=0.00228, 5000=0.00188 (USD); Case/Package: 0402; Number of Pins: 2; Case Code (Imperial): 0402; Case Code (Metric): 1005; Min Operating Temperature: -55°C; Max Operating Temperature: 155°C; Resistor Type: Thick Film; Tolerance: 1%; Packaging: Tape and Reel; Voltage Rating: 50V; Termination: SMD/SMT; Length: 1mm; Height: 0.32mm; Width: 0.5mm; Depth: 0.5mm; REACH SVHC: Unknown; Lead Free: Lead Free; Military Standard: Not; ComponentLink2URL: https://datasheet.ciiva.com/12666/pyu-rc0402-51-rohs-l-6-r-12666741.pdf; ComponentLink2Description: Online datasheet; Supplier 2: Mouser; Stock 2: 11912978; Pricing 2: 1=0.10000, 10=0.01200, 100=0.00400, 1000=0.00400, 2500=0.00400, 10000=0.00300 (USD); Supplier 3: Farnell; Stock 3: 29900; Pricing 3: 1=0.08130, 25=0.01210, 100=0.01120, 250=0.01030, 500=0.00900 (GBP); Supplier Part Number 3: 2132441; Supplier Part Number 2: 603-RC0402FR-071KL; Supplier Part Number 1: 311-1.00KLRDKR-ND; Created: D.G; Checked: ?
R14 = RC0402FR-07220RL: RES SMD 220 OHM 1% 1/16W 0402; Manufacturer: Yageo; Power Rating: 62.5mW; Voltage Rating: 50V; Temperature Coefficient: 100ppm/°C; Max Power Dissipation: 63mW; Supplier 1: Digi-Key; Manufacturer Part Number: RC0402FR-07220RL; RoHS: Yes; Category: Resistors; Stock 1: 1286042; Pricing 1: 1=0.10000, 10=0.01400, 100=0.00580, 1000=0.00262, 2500=0.00228, 5000=0.00188 (USD); Case/Package: 0402; Number of Pins: 2; Case Code (Metric): 1005; Min Operating Temperature: -55°C; Max Operating Temperature: 155°C; Packaging: Tape and Reel; Voltage Rating (DC): 50V; Package Quantity: 1; Termination: SMD/SMT; Resistor Type: Thick Film; Number of Terminations: 2; Features: Moisture Resistant; Length: 1mm; Height: 0.016inch; Width: 0.02inch; Depth: 0.5mm; REACH SVHC: No SVHC; Military Standard: Not; Lead Free: Lead Free; ComponentLink1URL: https://datasheet.ciiva.com/11819/0900766b80c66297-11819466.pdf?src-supplier=RSComponents; ComponentLink1Description: https://datasheet.ciiva.com/11819/0900766b80c66297-11819466.pdf?src-supplier=RSComponents; ComponentLink2URL: https://datasheet.ciiva.com/2453/pyu-r-int-thick-7-2453460.pdf?src-supplier=Digi-Key; ComponentLink2Description: https://datasheet.ciiva.com/2453/pyu-r-int-thick-7-2453460.pdf?src-supplier=Digi-Key; ComponentLink3URL: https://datasheet.ciiva.com/2453/pyu-r-int-thick-7-2453461.pdf?src-supplier=Digi-Key; ComponentLink3Description: https://datasheet.ciiva.com/2453/pyu-r-int-thick-7-2453461.pdf?src-supplier=Digi-Key; ComponentLink4URL: https://datasheet.ciiva.com/2453/pyu-r-int-thick-7-2453462.pdf?src-supplier=Digi-Key; ComponentLink4Description: https://datasheet.ciiva.com/2453/pyu-r-int-thick-7-2453462.pdf?src-supplier=Digi-Key; ComponentLink5URL: https://datasheet.ciiva.com/16746/pyu-rc0402-51-rohs-l-6-r-16746831.pdf?src-supplier=Future+Electronics; ComponentLink5Description: https://datasheet.ciiva.com/16746/pyu-rc0402-51-rohs-l-6-r-16746831.pdf?src-supplier=Future+Electronics; Supplier 2: Mouser; Stock 2: 324625; Pricing 2: 1=0.10000, 10=0.01200, 100=0.00400, 1000=0.00400, 2500=0.00400, 10000=0.00300 (USD); Supplier 3: Farnell; Stock 3: 18234; Pricing 3: 1=0.08130, 25=0.01210, 100=0.01120, 250=0.01030, 500=0.00900 (GBP); Supplier Part Number 3: 2147864; Supplier Part Number 2: 603-RC0402FR-07220RL; Supplier Part Number 1: 311-220LRCT-ND; Created: D.G; Checked: ?
SW1 = EVQ-P42B3M: Switch Tactile N.O. SPST Button J-Bend 0.02A 15VDC 1.6N SMD Embossed T/R; Mechanical Life: 1000000Cycles; Actuator Color: Natural; Max Voltage Rating (DC): 15V; Current Rating: 20mA; Voltage Rating (AC): 250V; Contact Resistance: 100mR; Illumination Type: Non-Illuminated; Switch Travel: 0.25mm; Switch Function: Off-Mom; Supplier 1: Digi-Key; Supplier 2: Mouser; Supplier 3: RSComponents; Supplier Part Number 3: 1250217; Supplier Part Number 1: P15502CT-ND; Supplier Part Number 2: 667-EVQ-P42B3M; Manufacturer 3: Panasonic; Manufacturer Part Number 3: EVQ-P42B3M; RoHS: Yes; Category: Tactile Switches; Stock 3: 310; Pricing 3: 10=0.78800 (USD); Mount: Edge,Surface Mount; Case/Package: SMD/SMT; Min Operating Temperature: -40°C; Max Operating Temperature: 85°C; Operating Force: 1.6N; Throw Configuration: SPST; Termination: J-Bend; Package Quantity: 1; Packaging: Tape and Reel; Voltage Rating (DC): 15V; Max Current Rating: 20mA; Electrical Life: 1000000Cycles; Orientation: Right Angle; Series: EVQP4; Length: 6.2mm; Depth: 3mm; Size: 3.5mm; Radiation Hardening: No; RoHS Compliant: Yes; ComponentLink1URL: https://datasheet.ciiva.com/16439/atk0000ce18-16439727.pdf?src-supplier=Future+Electronics; ComponentLink1Description: CIIVA datasheet; ComponentLink2URL: Y:\System\Altium\Libraries 2014\Panasonic\datasheets\EVQ-P4.pdf; ComponentLink2Description: datasheet (offline); Manufacturer Part Number: EVQ-P42B3M
TP2-TP6 = TestPoint: Test Point
U1 = NCP114ASN330T1G: ON SEMICONDUCTOR - NCP114ASN330T1G - LDO Voltage Regulator, Fixed, 1.7 V to 5.5 V in, 3.3 V/300 mA out, 150 mV drop, TSOP-5; Output Current: 300mA; Output Configuration: Positive; Number of Regulators: 1; Max Input Voltage: 5.5V; Min Output Voltage: 3.3V; Dropout Voltage: 225mV; Quiescent Current: 95uA; Power Supply Rejection Ratio (PSRR): 75dB; Supplier 1: Digi-Key; RoHS: No; Category: Voltage Regulators - Linear; Stock 1: 32529; Pricing 1: 1=0.33000, 10=0.24900, 25=0.21760, 100=0.12440, 250=0.11664, 500=0.09330, 1000=0.07153 (USD); Mount: Surface Mount; Case/Package: SOT-23-5; Min Operating Temperature: -40°C; Max Operating Temperature: 85°C; Output Type: Fixed; Packaging: Cut Tape; Lead Free: Lead Free; ComponentLink3URL: http://www.onsemi.com/pub/Collateral/NCP114-D.PDF; ComponentLink3Description: On Semi datasheet online; Supplier 2: RSComponents; Supplier 3: Mouser; Supplier Part Number 3: 863-NCP114ASN330T1G; Supplier Part Number 2: 1263178; Supplier Part Number 1: NCP114ASN330T1GOSCT-ND; Created: DG; Checked: ?; Manufacturer: ON Semiconductor; Manufacturer Part Number: NCP114ASN330T1G
U2 U3 U5 = TPS2553DBVR_ALT: POWER LOAD SWITCH, HIGH SIDE, SOT-23-6; Power Load Switch Type:High Side; Input Voltage:6.5V; Current Limit:1.7A; On State Resistance:0.085ohm; Distribution Switch Case Style:SOT-23; No. of Pins:6; Thermal Protection:Yes; On / Enable;RoHS Compliant: Yes; Manufacturer 1: Texas Instruments; Number of Outputs: 1; Min Supply Voltage: 2.5V; Max Supply Voltage: 6.5V; On-State Resistance: 85mR; Output Current: 1.5A; Max Power Dissipation: 625mW; Supplier 1: Digi-Key; RoHS: Yes; Category: Hot Swap Controllers; Stock 1: 14713; Pricing 1: 1=1.20000, 10=1.07100, 25=1.01640, 100=0.78050, 250=0.68972, 500=0.65340, 1000=0.50820 (USD); Case/Package: SOT-23; Number of Pins: 6; Weight: 0.00127oz; Min Operating Temperature: -40°C; Max Operating Temperature: 85°C; Packaging: Tape and Reel; Package Quantity: 1; Max Input Voltage: 6.5V; Min Input Voltage: 2.5V; Radiation Hardening: No; Lead Free: Lead Free; REACH SVHC: No SVHC; ComponentLink1URL: https://datasheet.ciiva.com/15108/getdatasheetpartid-297517-15108509.pdf?src-supplier=Verical; ComponentLink1Description: https://datasheet.ciiva.com/15108/getdatasheetpartid-297517-15108509.pdf?src-supplier=Verical; Supplier 2: Farnell; Supplier 3: Mouser; Supplier Part Number 3: 595-TPS2553DBVR; Supplier Part Number 2: 3124082; Supplier Part Number 1: 296-32464-1-ND
U4 = BM833: Supplier 1: Digi-Key; Manufacturer 1: Fanstel; RoHS: No; Category: RF Receivers, Transceivers; Stock 1: 879; Pricing 1: 1=10.43000, 10=9.55900, 25=8.69000, 100=7.82100, 250=7.16924, 500=6.51750 (USD); Supplier 2: Mouser; Supplier Part Number 2: 308-BM833; Supplier Part Number 1: 1914-BM833CT-ND; ComponentLink1Description: Datasheet (offline); ComponentLink1URL: Y:\System\Altium\Libraries 2014\Fanstel\Datasheets\BM833_datasheets.pdf; ComponentLink2Description: Datasheet (online); ComponentLink2URL: https://www.fanstel.com/s/BM833_datasheets-rs9l.pdf; Manufacturer Part Number 1: BM833